# Altium schematic sheet hand.SchDoc
size A3
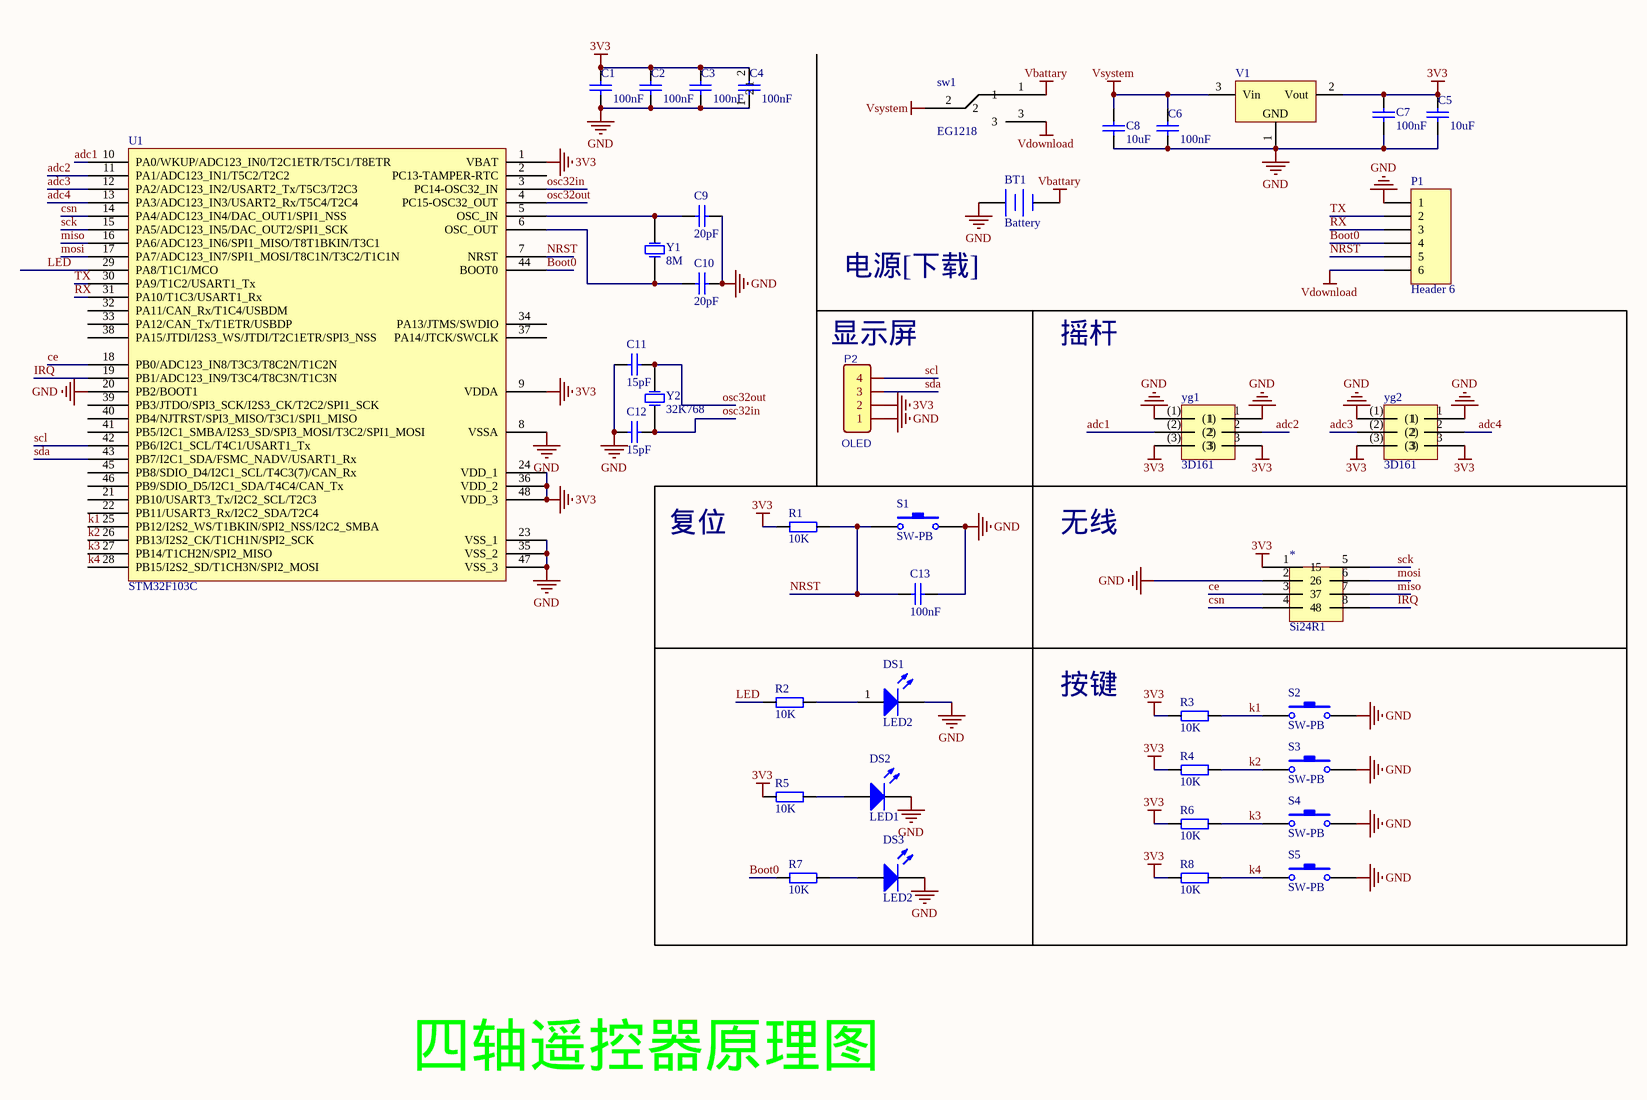
[diagram p0: hand.SchDoc]

## Parts
*  Si24R1  [WIRELM-SMD_DL-SI24R1-A]
BT1  Battery  [CONN-TH_2P-P2.00_HDGC_HDGC2001WV-2P]
C1  100nF  [C0603]
C2  100nF  [C0603]
C3  100nF  [C0603]
C4  100nF  [C0603]
C5  10uF  [C0603]
C6  100nF  [C0603]
C7  100nF  [C0603]
C8  10uF  [C0603]
C9  20pF  [C0603]
C10  20pF  [C0603]
C11  15pF  [C0603]
C12  15pF  [C0603]
C13  100nF  [C0603]
DS1  LED2  [SMDLED]
DS2  LED1  [SMDLED]
DS3  LED2  [SMDLED]
P1  Header 6  [HDR-TH_6P-P2.54-V-M-R2-C3-S2.54-1]
P2  OLED  [P04A]
R1  10K  [0603P]
R2  10K  [0603P]
R3  10K  [0603P]
R4  10K  [0603P]
R5  10K  [0603P]
R6  10K  [0603P]
R7  10K  [0603P]
R8  10K  [0603P]
S1  SW-PB  [KEY-SMD_L3.9-W3.0-LS5.0]
S2  SW-PB  [KEY-SMD_L3.9-W3.0-LS5.0]
S3  SW-PB  [KEY-SMD_L3.9-W3.0-LS5.0]
S4  SW-PB  [KEY-SMD_L3.9-W3.0-LS5.0]
S5  SW-PB  [KEY-SMD_L3.9-W3.0-LS5.0]
sw1  EG1218  [SW-TH_EG1218]
U1  STM32F103C  [LQFP-48_M]
V1  AMS1117-3V3  [SOT223_L]  (value not drawn)
Y1  8M  [XTAL(5032)]
Y2  32K768  [CRYSTAL-SMD_L3.2-W1.5-1]
yg1  3D161  [SW-TH_3D161]
yg2  3D161  [SW-TH_3D161]

## Blocks framed on the sheet
按键: DS1-DS3 R2-R8 S2-S5

## Nets
3V3: *.1 C1.2 C2.2 C3.2 C4.2 C5.2 C7.2 P2.2 R1.1 R3.1 R4.1 R5.1 R6.1 R8.1 U1.1(VBAT) U1.9(VDDA) U1.24(VDD_1) U1.36(VDD_2) U1.48(VDD_3) V1.2(Vout) yg1.3 yg1.(3) yg2.3 yg2.(3)
GND: *.2 BT1.1(+) C1.1 C2.1 C3.1 C4.1 C5.1 C6.1 C7.1 C8.1 C9.2 C10.2 C11.1 C12.1 C13.2 DS1.2(K) DS2.2(K) DS3.2(K) P1.1 P2.1 S1.2 S2.2 S3.2 S4.2 S5.2 U1.8(VSSA) U1.20(PB2/BOOT1) U1.23(VSS_1) U1.35(VSS_2) U1.47(VSS_3) V1.1(GND) yg1.1 yg1.(1) yg2.1 yg2.(1)
Vbattary: BT1.2(-) sw1.1
Vdownload: P1.6 sw1.3
Vsystem: C6.2 C8.2 sw1.2 V1.3(Vin)
adc1: U1.10(PA0/WKUP/ADC123_IN0/T2C1ETR/T5C1/T8ETR) yg1.(2)
adc2: U1.11(PA1/ADC123_IN1/T5C2/T2C2) yg1.2
adc3: U1.12(PA2/ADC123_IN2/USART2_Tx/T5C3/T2C3) yg2.(2)
adc4: U1.13(PA3/ADC123_IN3/USART2_Rx/T5C4/T2C4) yg2.2
Boot0: P1.4 R7.1 U1.44(BOOT0)
ce: *.3 U1.18(PB0/ADC123_IN8/T3C3/T8C2N/T1C2N)
csn: *.4 U1.14(PA4/ADC123_IN4/DAC_OUT1/SPI1_NSS)
IRQ: *.8 U1.19(PB1/ADC123_IN9/T3C4/T8C3N/T1C3N)
k1: R3.2 S2.1 U1.25(PB12/I2S2_WS/T1BKIN/SPI2_NSS/I2C2_SMBA)
k2: R4.2 S3.1 U1.26(PB13/I2S2_CK/T1CH1N/SPI2_SCK)
k3: R6.2 S4.1 U1.27(PB14/T1CH2N/SPI2_MISO)
k4: R8.2 S5.1 U1.28(PB15/I2S2_SD/T1CH3N/SPI2_MOSI)
LED: R2.1 U1.29(PA8/T1C1/MCO)
miso: *.7 U1.16(PA6/ADC123_IN6/SPI1_MISO/T8T1BKIN/T3C1)
mosi: *.6 U1.17(PA7/ADC123_IN7/SPI1_MOSI/T8C1N/T3C2/T1C1N)
NRST: C13.1 P1.5 R1.2 S1.1 U1.7(NRST)
osc32in: C12.2 U1.3(PC14-OSC32_IN) Y2.1(OSC1)
osc32out: C11.2 U1.4(PC15-OSC32_OUT) Y2.2(OSC2)
RX: P1.3 U1.31(PA10/T1C3/USART1_Rx)
sck: *.5 U1.15(PA5/ADC123_IN5/DAC_OUT2/SPI1_SCK)
scl: P2.4 U1.42(PB6/I2C1_SCL/T4C1/USART1_Tx)
sda: P2.3 U1.43(PB7/I2C1_SDA/FSMC_NADV/USART1_Rx)
TX: P1.2 U1.30(PA9/T1C2/USART1_Tx)
NetC9_1: C9.1 U1.5(OSC_IN) Y1.2(OSC2)
NetC10_1: C10.1 U1.6(OSC_OUT) Y1.1(OSC1)
NetDS1_1: DS1.1(A) R2.2
NetDS2_1: DS2.1(A) R5.2
NetDS3_1: DS3.1(A) R7.2

Not connected (* = marked no-connect by the designer): U1 2(PC13-TAMPER-RTC) 21(PB10/USART3_Tx/I2C2_SCL/T2C3) 22(PB11/USART3_Rx/I2C2_SDA/T2C4) 32(PA11/CAN_Rx/T1C4/USBDM) 33(PA12/CAN_Tx/T1ETR/USBDP) 34(PA13/JTMS/SWDIO) 37(PA14/JTCK/SWCLK) 38(PA15/JTDI/I2S3_WS/JTDI/T2C1ETR/SPI3_NSS) 39(PB3/JTDO/SPI3_SCK/I2S3_CK/T2C2/SPI1_SCK) 40(PB4/NJTRST/SPI3_MISO/T3C1/SPI1_MISO) 41(PB5/I2C1_SMBA/I2S3_SD/SPI3_MOSI/T3C2/SPI1_MOSI) 45(PB8/SDIO_D4/I2C1_SCL/T4C3(7)/CAN_Rx) 46(PB9/SDIO_D5/I2C1_SDA/T4C4/CAN_Tx)

## Notes on the sheet
- 电源[下载]
- (near P2) 显示屏
- 摇杆
- 复位
- 无线
- 四轴遥控器原理图

## Library data of the parts
BT1 = Battery: 采用ph2.0接线端子; Published: 24-Mar-1999; LatestRevisionDate: 17-Jul-2002; LatestRevisionNote: Re-released for DXP Platform.; PackageReference: BAT-2; Publisher: Altium Limited; PackageDescription: Battery; 2 Leads
C1-C13 = Cap: Capacitor; Published: 8-Jun-2000; LatestRevisionDate: 17-Jul-2002; LatestRevisionNote: Re-released for DXP Platform.; PackageReference: RAD-0.3; Publisher: Altium Limited; PackageDescription: Radial Cap, Thru-Hole; 2 Leads; 0.3 in Pin Spacing
  C1-C4 C6 C7 C13: Value: 100nF
  C5 C8: Value: 10uF
  C9 C10: Value: 20pF
  C11 C12: Value: 15pF
DS1-DS3 = LED2: Typical RED, GREEN, YELLOW, AMBER GaAs LED; Published: 8-Jun-2000; LatestRevisionDate: 17-Jul-2002; LatestRevisionNote: Re-released for DXP Platform.; PackageDocument: Feb-2002; PackageReference: 3.2X1.6X1.1; Publisher: Altium Limited
P1 = Header 6: Header, 6-Pin; LatestRevisionDate: 17-Jul-2002; LatestRevisionNote: Re-released for DXP Platform.; Publisher: Altium Limited
P2 = OLED: BOM_Manufacturer Part: 2.54-1*4P母; BOM_Manufacturer: BOOMELE(博穆精密); Contributor: PQG2030PQG; BOM_Supplier: LCSC; image: http://image.lceda.cn/szlcsc/C57369.jpg; BOM_Supplier Part: C2718488; spicePre: P; spiceSymbolName: R-HEADE 4P
R1-R8 = R
S1-S5 = SW-PB: Switch; Published: 24-Mar-1999; LatestRevisionDate: 17-Jul-2002; LatestRevisionNote: Re-released for DXP Platform.; PackageReference: SPST-2; Publisher: Altium Limited; PackageDescription: Switch; 2 Leads
U1 = STM32F103C: STM32单片机48引脚
V1 = AMS1117: 三端稳压芯片; BOM名称: 稳压芯片; 版权归属: 源创客; 学习资源: www.ooocke.com
Y1 Y2 = XTAL: Crystal Oscillator; Published: 8-Jun-2000; LatestRevisionDate: 17-Jul-2002; LatestRevisionNote: Re-released for DXP Platform.; PackageReference: R38; Publisher: Altium Limited; PackageDescription: Crystal, Thru-Hole; 2 Leads; Body 3.1 x 8.2 mm (Dia.xH)